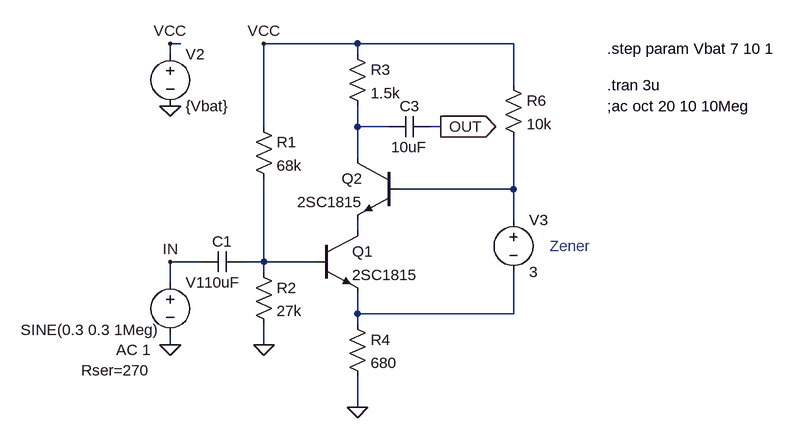
[diagram p0: schematic BaseCommon_Cascode_BootStrap.asc]
BaseCommon_Cascode_BootStrap.asc, the LTspice schematic file:
Version 4
SHEET 1 1048 696
WIRE 80 0 64 0
WIRE 352 0 208 0
WIRE 592 0 352 0
WIRE 64 16 64 0
WIRE 352 16 352 0
WIRE 592 64 592 0
WIRE 208 128 208 0
WIRE 352 128 352 96
WIRE 400 128 352 128
WIRE 480 128 464 128
WIRE 352 176 352 128
WIRE 592 224 592 144
WIRE 592 224 416 224
WIRE 592 272 592 224
WIRE 352 288 352 272
WIRE 112 336 64 336
WIRE 208 336 208 208
WIRE 208 336 176 336
WIRE 288 336 208 336
WIRE 208 352 208 336
WIRE 64 368 64 336
WIRE 352 416 352 384
WIRE 592 416 592 352
WIRE 592 416 352 416
WIRE 352 432 352 416
WIRE 64 464 64 448
WIRE 208 464 208 432
WIRE 352 560 352 512
FLAG 208 464 0
FLAG 64 464 0
FLAG 64 336 IN
FLAG 480 128 OUT
IOPIN 480 128 Out
FLAG 64 96 0
FLAG 64 0 VCC
FLAG 208 0 VCC
FLAG 352 560 0
SYMBOL npn 416 176 M0
SYMATTR InstName Q2
SYMATTR Value 2SC1815
SYMBOL res 192 112 R0
SYMATTR InstName R1
SYMATTR Value 68k
SYMBOL res 192 336 R0
SYMATTR InstName R2
SYMATTR Value 27k
SYMBOL res 336 0 R0
SYMATTR InstName R3
SYMATTR Value 1.5k
SYMBOL res 336 416 R0
SYMATTR InstName R4
SYMATTR Value 680
SYMBOL cap 176 320 R90
WINDOW 0 0 32 VBottom 2
WINDOW 3 32 32 VTop 2
SYMATTR InstName C1
SYMATTR Value 10uF
SYMBOL voltage 64 352 R0
WINDOW 123 -83 120 Left 2
WINDOW 39 -137 151 Left 2
WINDOW 3 -230 89 Left 2
SYMATTR Value2 AC 1
SYMATTR SpiceLine Rser=270
SYMATTR Value SINE(0.3 0.3 1Meg)
SYMATTR InstName V1
SYMBOL voltage 64 0 R0
SYMATTR InstName V2
SYMATTR Value {Vbat}
SYMBOL npn 288 288 R0
SYMATTR InstName Q1
SYMATTR Value 2SC1815
SYMBOL res 576 48 R0
SYMATTR InstName R6
SYMATTR Value 10k
SYMBOL cap 464 112 R90
WINDOW 0 0 32 VBottom 2
WINDOW 3 32 32 VTop 2
SYMATTR InstName C3
SYMATTR Value 10uF
SYMBOL voltage 592 256 R0
WINDOW 123 0 0 Left 2
WINDOW 39 0 0 Left 2
SYMATTR InstName V3
SYMATTR Value 3
TEXT 736 64 Left 2 !.tran 3u
TEXT 736 96 Left 2 !;ac oct 20 10 10Meg
TEXT 736 8 Left 2 !.step param Vbat 7 10 1
TEXT 648 312 Left 2 ;Zener

The netlist it stands for:
* BaseCommon_Cascode_BootStrap.asc
Q2 N001 N002 N003 0 2SC1815
R1 VCC N004 68k
R2 N004 0 27k
R3 VCC N001 1.5k
R4 N005 0 680
C1 N004 IN 10uF
V1 IN 0 SINE(0.3 0.3 1Meg) AC 1 Rser=270
V2 VCC 0 {Vbat}
Q1 N003 N004 N005 0 2SC1815
R6 VCC N002 10k
C3 OUT N001 10uF
V3 N002 N005 3
.model NPN NPN
.model PNP PNP
.lib standard.bjt
.tran 3u
;ac oct 20 10 10Meg
.step param Vbat 7 10 1
* Zener
.backanno
.end